# Altium schematic sheet CEA2045.SchDoc
size A
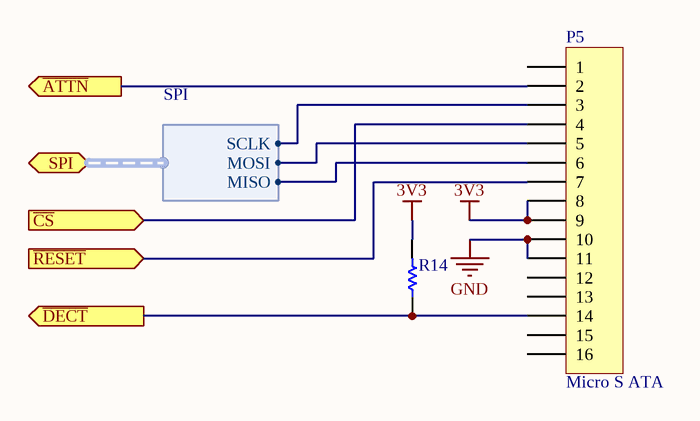
[diagram p0: CEA2045.SchDoc]

## Parts
P5  Micro S ATA  [HDR1X16]
R14  1K 5% 0603(1608)  [RESC0603(1608)_L]  (value not drawn)

## Ports
SPI (harness SPI), ~{ATTN} (out), ~{CS} (in), ~{DECT} (out), ~{RESET} (in)

## Harnesses
SPI: MISO, MOSI, SCLK

## Nets
3V3: P5.8 P5.9 R14.2
GND: P5.10 P5.11
~{ATTN}: P5.2 ; port ~{ATTN}
~{CS}: P5.4 ; port ~{CS}
~{DECT}: P5.14 R14.1 ; port ~{DECT}
~{RESET}: P5.7 ; port ~{RESET}
NetP5_3: P5.3 ; port SPI.SCLK
NetP5_5: P5.5 ; port SPI.MOSI
NetP5_6: P5.6 ; port SPI.MISO

Not connected (* = marked no-connect by the designer): P5 1 12 13 15 16

## Library data of the parts
P5 = Header 16: Header, 16-Pin; LatestRevisionDate: 17-Jul-2002; LatestRevisionNote: Re-released for DXP Platform.; Publisher: Altium Limited
R14 = CMP-1012-00074-1: 1K 0.1W 5% 0603 (1608 Metric)  SMD; Case-Metric: 1608; Value: 1000.00 Ohm; Case-EIA: 0603; Power: 0.1 W; Tolerance: 5 %; Technology: SMT